# EAGLE board FlipDot (EAGLE 7.5.0), part 1 of 2
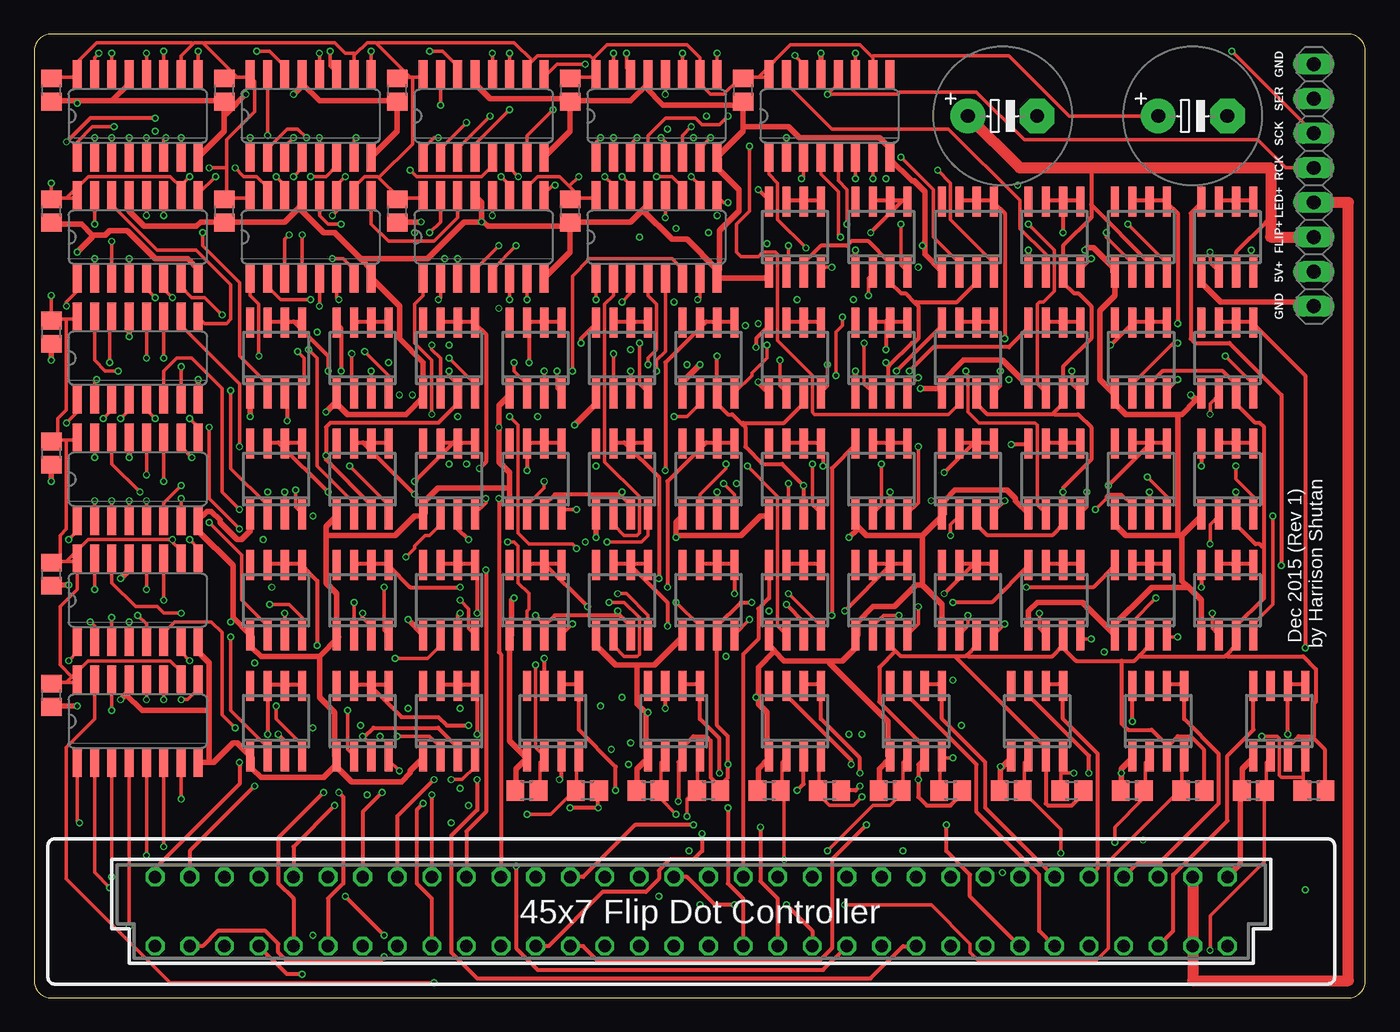
[diagram p9: board, top side]
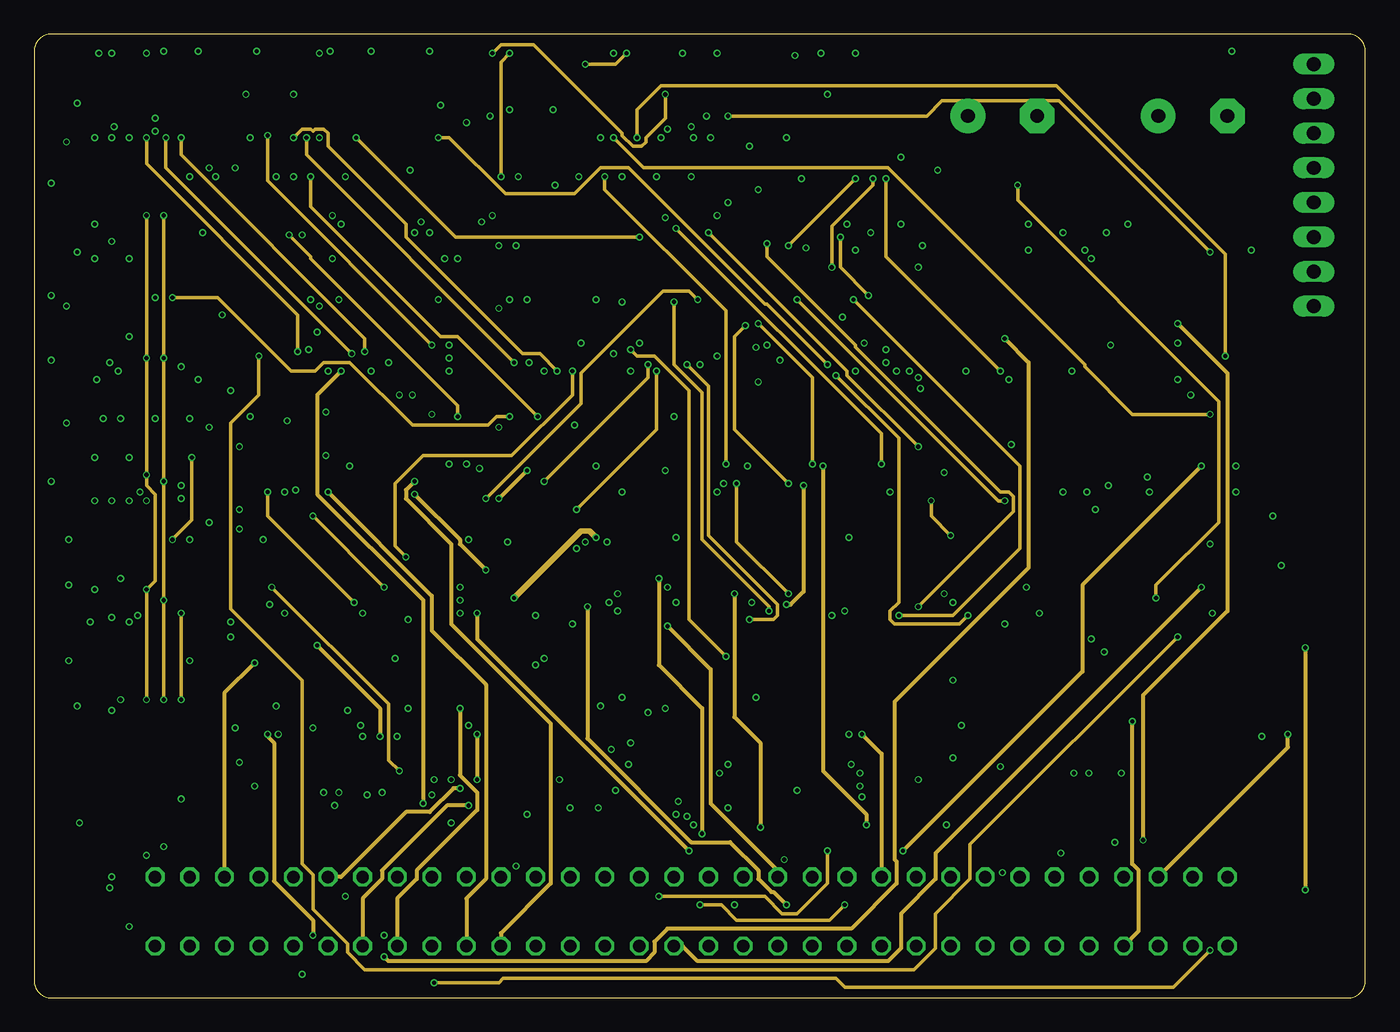
[diagram p10: board, inner layer Route2]
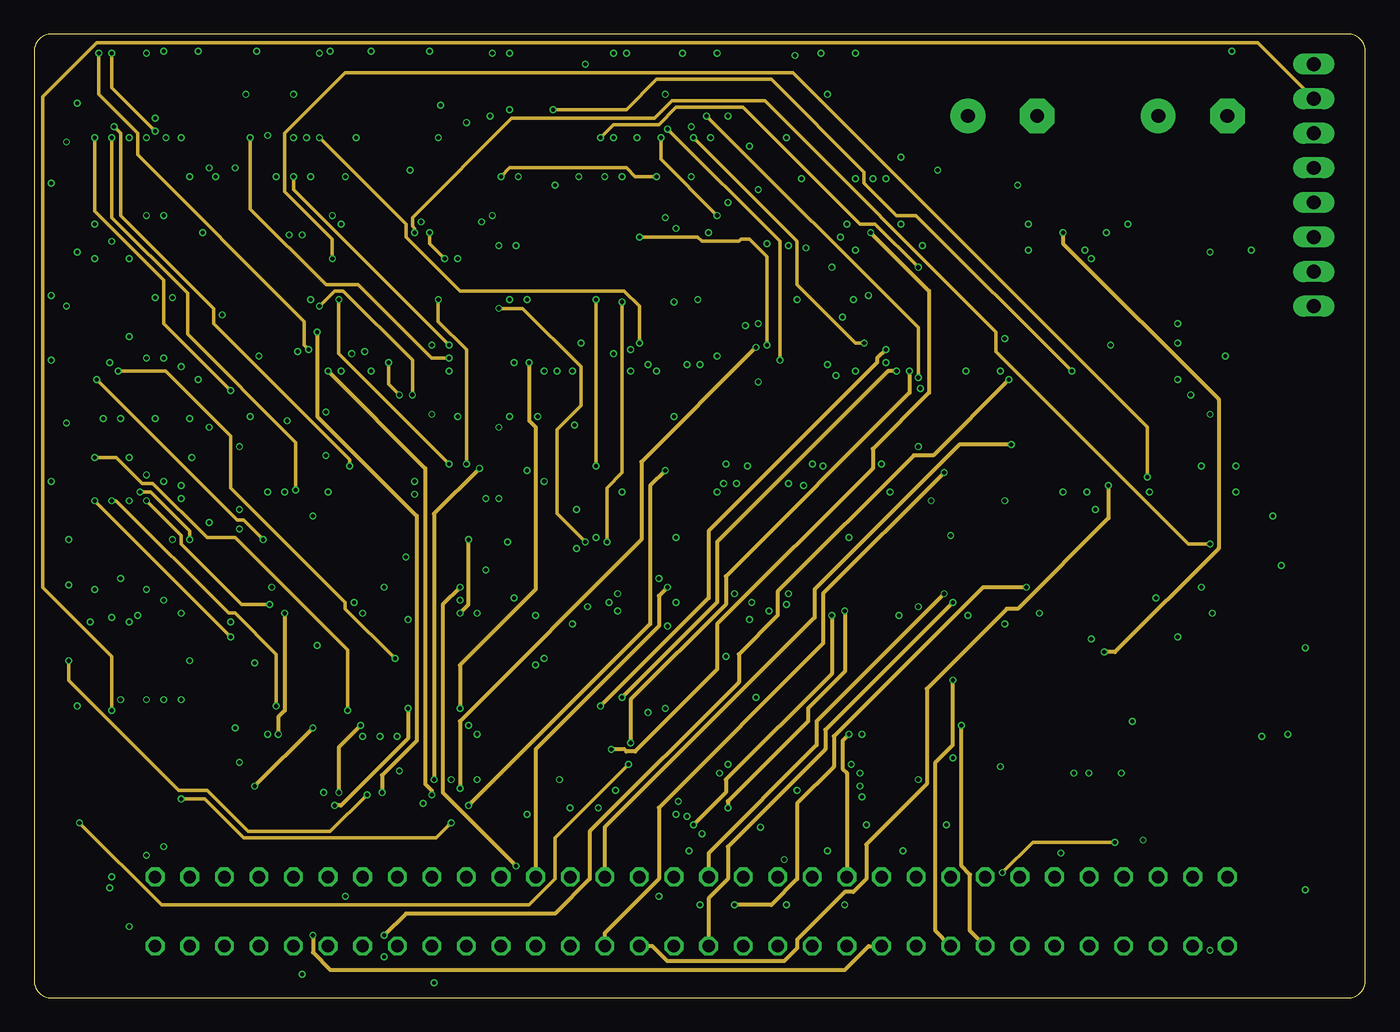
[diagram p11: board, inner layer Route15]
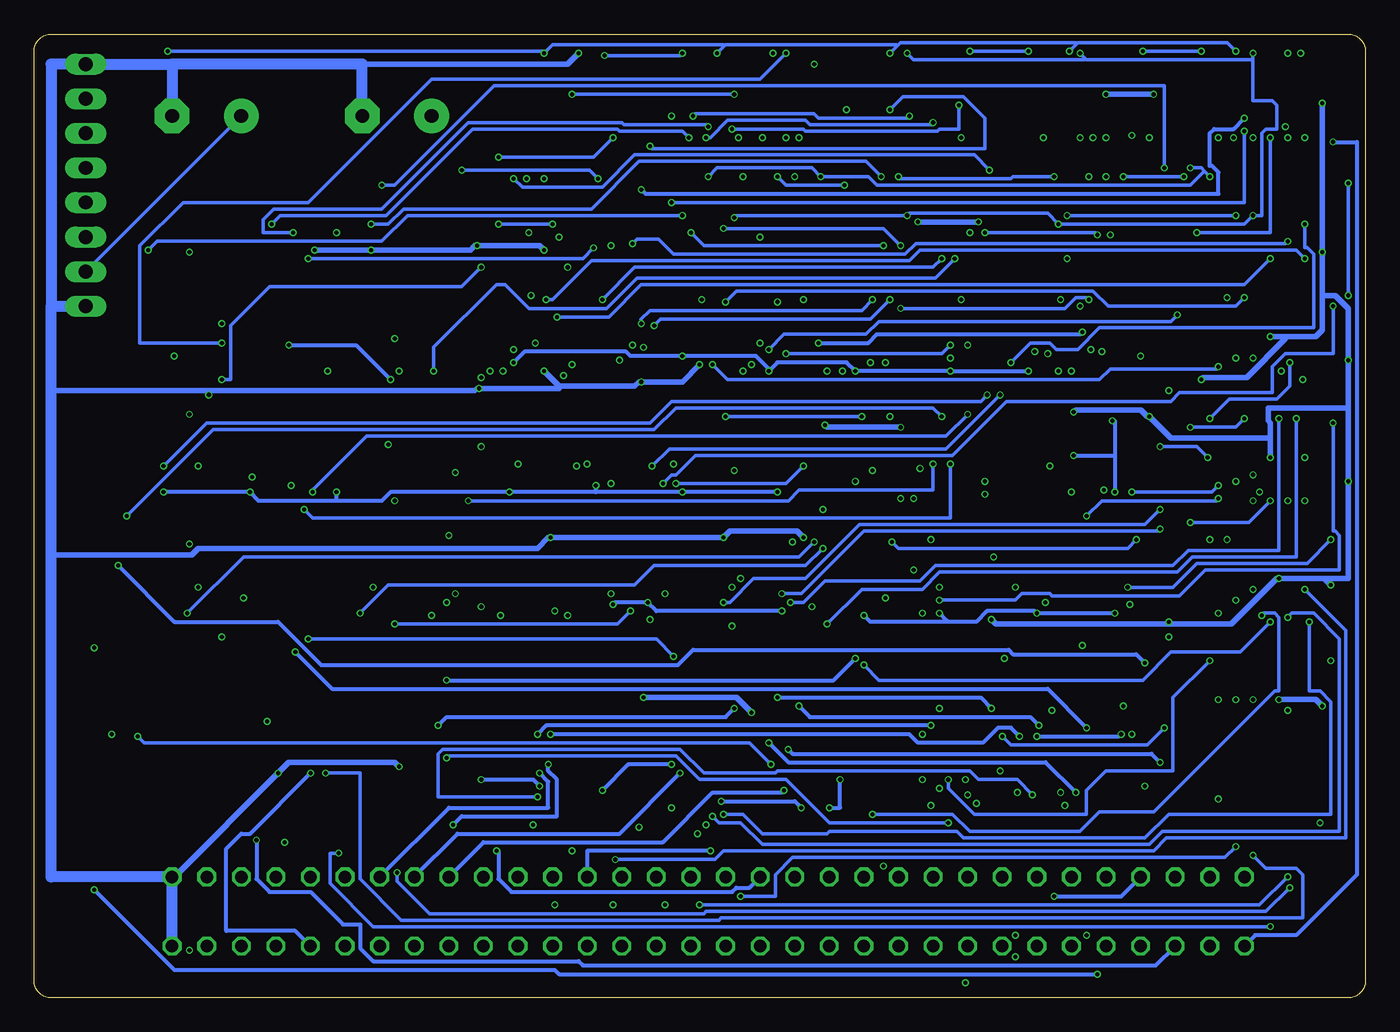
[diagram p12: board, bottom side, seen from below]

Size 97.77 x 70.79 mm. Coordinates in mm from the lower left corner, seen from the top.
Outline: 0,69.52 0,1.27 arc90 1.27,0 96.5,0 arc90 97.77,1.27 97.77,69.52 arc90 96.5,70.79 1.27,70.79 arc90 0,69.52
Copper layers (1*2*15*16): Top 0.035559375mm / dielectric 0.17018125mm / Route2 0.01778125mm / dielectric 47mil / Route15 0.01778125mm / dielectric 0.17018125mm / Bottom 0.035559375mm
Design rules "OSHPark-4layer": minimum track width 5mil, minimum drill 10mil, track to track 5mil, track to pad 5mil, pad to pad 5mil, via to via 5mil, smd to smd 5mil, copper to edge 15mil, drill to drill 6mil, minimum pad ring 4mil, minimum via ring 4mil, stop-mask expansion 2.5mil, vias tented up to drill 0mil, thermal gap 10mil
Net classes: 0 default: width 0.254 mm, drill 0.305 mm, clearance 0.203 mm; 1 flipvoltpositive: width 0.305 mm, drill 0.305 mm, clearance 0.203 mm; 2 ledpos: width 0.762 mm, drill 0.305 mm, clearance 0.203 mm; 3 gnd: width 0.406 mm, drill 0.305 mm, clearance 0.203 mm; 4 fetcommons: width 0.305 mm, drill 0.305 mm, clearance 0.203 mm

## Footprints (pad centres in the part's own frame; a part is rotated, then mirrored left to right if it is on the bottom)
C2012 = smd 1.3 x 1.5: 1 -0.85,0; 2 0.85,0
SO8 = smd 0.6 x 2.2: 1 -1.905,-2.6; 2 -0.635,-2.6; 3 0.635,-2.6; 4 1.905,-2.6; 5 1.905,2.6; 6 0.635,2.6; 7 -0.635,2.6; 8 -1.905,2.6
E5-10,5 = drill 1.016 pad 2.54: + -2.54,0 | drill 1.016 pad 2.54 octagon: - 2.54,0
1X08 = drill 1.016 long: 1 -8.89,0; 2 -6.35,0; 3 -3.81,0; 4 -1.27,0; 5 1.27,0; 6 3.81,0; 7 6.35,0; 8 8.89,0
R2012 = smd 1.3 x 1.5: 1 -0.85,0; 2 0.85,0
SO16 = smd 0.66 x 2.032: 1 -4.445,-3.073; 2 -3.175,-3.073; 3 -1.905,-3.073; 4 -0.635,-3.073; 5 0.635,-3.073; 6 1.905,-3.073; 7 3.175,-3.073; 8 4.445,-3.073; 9 4.445,3.073; 10 3.175,3.073; 11 1.905,3.073; 12 0.635,3.073; 13 -0.635,3.073; 14 -1.905,3.073; 15 -3.175,3.073; 16 -4.445,3.073
FAC64S = drill 0.914 octagon: A1 -2.54,39.37; A2 -2.54,36.83; A3 -2.54,34.29; A4 -2.54,31.75; A5 -2.54,29.21; A6 -2.54,26.67; A7 -2.54,24.13; A8 -2.54,21.59; A9 -2.54,19.05; A10 -2.54,16.51; A11 -2.54,13.97; A12 -2.54,11.43; A13 -2.54,8.89; A14 -2.54,6.35; A15 -2.54,3.81; A16 -2.54,1.27; A17 -2.54,-1.27; A18 -2.54,-3.81; A19 -2.54,-6.35; A20 -2.54,-8.89; A21 -2.54,-11.43; A22 -2.54,-13.97; A23 -2.54,-16.51; A24 -2.54,-19.05; A25 -2.54,-21.59; A26 -2.54,-24.13; A27 -2.54,-26.67; A28 -2.54,-29.21; A29 -2.54,-31.75; A30 -2.54,-34.29; A31 -2.54,-36.83; A32 -2.54,-39.37; C1 2.54,39.37; C2 2.54,36.83; C3 2.54,34.29; C4 2.54,31.75; C5 2.54,29.21; C6 2.54,26.67; C7 2.54,24.13; C8 2.54,21.59; C9 2.54,19.05; C10 2.54,16.51; C11 2.54,13.97; C12 2.54,11.43; C13 2.54,8.89; C14 2.54,6.35; C15 2.54,3.81; C16 2.54,1.27; C17 2.54,-1.27; C18 2.54,-3.81; C19 2.54,-6.35; C20 2.54,-8.89; C21 2.54,-11.43; C22 2.54,-13.97; C23 2.54,-16.51; C24 2.54,-19.05; C25 2.54,-21.59; C26 2.54,-24.13; C27 2.54,-26.67; C28 2.54,-29.21; C29 2.54,-31.75; C30 2.54,-34.29; C31 2.54,-36.83; C32 2.54,-39.37

## Placement (x,y rotation side)
C1  [C2012]  1.27,22.23 270 top
C2  [C2012]  1.27,31.11 270 top
C3  [C2012]  1.27,40.01 270 top
C4  [C2012]  1.27,48.9 270 top
C5  [C2012]  1.27,57.78 270 top
C6  [C2012]  13.97,57.78 270 top
C7  [C2012]  26.67,57.78 270 top
C8  [C2012]  39.37,57.78 270 top
C9  [C2012]  1.27,66.67 270 top
C10  [C2012]  13.97,66.67 270 top
C11  [C2012]  26.67,66.67 270 top
C12  [C2012]  39.37,66.67 270 top
C13  [C2012]  52.07,66.67 270 top
COL1.  AO4629  [SO8]  30.48,20.32 0 top
COL2.  AO4629  [SO8]  24.13,20.32 0 top
COL3.  AO4629  [SO8]  17.78,20.32 0 top
COL4.  AO4629  [SO8]  17.78,29.21 0 top
COL5.  AO4629  [SO8]  24.13,29.21 0 top
COL6.  AO4629  [SO8]  30.48,29.21 0 top
COL7.  [SO8]  36.83,29.21 0 top
COL8.  [SO8]  43.18,29.21 0 top
COL9.  [SO8]  49.53,29.21 0 top
COL10.  [SO8]  55.88,29.21 0 top
COL11.  [SO8]  62.23,29.21 0 top
COL12.  [SO8]  68.58,29.21 0 top
COL13.  [SO8]  74.93,29.21 0 top
COL14.  [SO8]  81.28,29.21 0 top
COL15.  [SO8]  87.63,29.21 0 top
COL16.  [SO8]  87.63,38.1 0 top
COL17.  [SO8]  81.28,38.1 0 top
COL18.  [SO8]  74.93,38.1 0 top
COL19.  [SO8]  68.58,38.1 0 top
COL20.  [SO8]  62.23,38.1 0 top
COL21.  [SO8]  55.88,38.1 0 top
COL22.  [SO8]  49.53,38.1 0 top
COL23.  [SO8]  43.18,38.1 0 top
COL24.  [SO8]  36.83,38.1 0 top
COL25.  [SO8]  30.48,38.1 0 top
COL26.  [SO8]  24.13,38.1 0 top
COL27.  [SO8]  17.78,38.1 0 top
COL28.  [SO8]  17.78,46.99 0 top
COL29.  [SO8]  24.13,46.99 0 top
COL30.  [SO8]  30.48,46.99 0 top
COL31.  [SO8]  36.83,46.99 0 top
COL32.  [SO8]  43.18,46.99 0 top
COL33.  [SO8]  49.53,46.99 0 top
COL34.  [SO8]  55.88,46.99 0 top
COL35.  [SO8]  62.23,46.99 0 top
COL36.  [SO8]  68.58,46.99 0 top
COL37.  [SO8]  74.93,46.99 0 top
COL38.  [SO8]  81.28,46.99 0 top
COL39.  [SO8]  87.63,46.99 0 top
COL40.  [SO8]  87.63,55.88 0 top
COL41.  [SO8]  81.28,55.88 0 top
COL42.  [SO8]  74.93,55.88 0 top
COL43.  [SO8]  68.58,55.88 0 top
COL44.  [SO8]  62.23,55.88 0 top
COL45.  [SO8]  55.88,55.88 0 top
FLIPCAP  [E5-10,5]  71.12,64.77 0 top
JP1  [1X08]  93.98,59.69 90 top
LOGICCAP  [E5-10,5]  85.09,64.77 0 top
R1  10k  [R2012]  89.53,15.24 0 top
R2  10k  [R2012]  93.98,15.24 0 top
R3  10k  [R2012]  80.64,15.24 0 top
R4  10k  [R2012]  85.09,15.24 0 top
R5  10k  [R2012]  71.75,15.24 0 top
R6  10k  [R2012]  76.2,15.24 0 top
R7  10k  [R2012]  62.87,15.24 0 top
R8  10k  [R2012]  67.31,15.24 0 top
R9  10k  [R2012]  53.98,15.24 0 top
R10  10k  [R2012]  58.42,15.24 0 top
R11  10k  [R2012]  45.09,15.24 0 top
R12  10k  [R2012]  49.53,15.24 0 top
R13  10k  [R2012]  36.2,15.24 0 top
R14  10k  [R2012]  40.64,15.24 0 top
ROW1.  [SO8]  91.44,20.32 0 top
ROW2.  [SO8]  82.55,20.32 0 top
ROW3.  [SO8]  73.66,20.32 0 top
ROW4.  [SO8]  64.77,20.32 0 top
ROW5.  [SO8]  55.88,20.32 0 top
ROW6.  [SO8]  46.99,20.32 0 top
ROW7.  [SO8]  38.1,20.32 0 top
SR1  74LS595D  [SO16]  7.62,20.32 0 top
SR2  74LS595D  [SO16]  7.62,29.21 0 top
SR3  74LS595D  [SO16]  7.62,38.1 0 top
SR4  74LS595D  [SO16]  7.62,46.99 0 top
SR5  74LS595D  [SO16]  7.62,55.88 0 top
SR6  74LS595D  [SO16]  20.32,55.88 0 top
SR7  74LS595D  [SO16]  33.02,55.88 0 top
SR8  74LS595D  [SO16]  45.72,55.88 0 top
SR9  74LS595D  [SO16]  7.62,64.77 0 top
SR10  74LS595D  [SO16]  20.32,64.77 0 top
SR11  74LS595D  [SO16]  33.02,64.77 0 top
SR12  74LS595D  [SO16]  45.72,64.77 0 top
SR13  74LS595D  [SO16]  58.42,64.77 0 top
X1  FAC64S  [FAC64S]  48.26,6.35 270 top

## Tracks (layer width: path | path; a pad name or v marks a point on that pad's centre or on a via)
COL1COMMON  (via drill 0.3)
  Top 0.305: 31.11,23.02 29.84,23.02 COL1..7 | 31.11,23.02 32.38,23.02 COL1..5 32.38,22.86 32.54,22.7 v32.54,19.37 | 31.11,23.02 COL1..6 | X1.C10 63.82,3.81 61.44,1.43 32.54,1.43 30.64,3.33 30.64,11.91 32.54,13.81 v32.54,16.03
  Route2 0.305: v32.54,19.37 v32.54,16.03
COL2COMMON  (via drill 0.3)
  Top 0.305: 24.77,23.02 23.5,23.02 COL2..7 | 24.77,23.02 26.04,23.02 COL2..5 | 24.77,23.02 COL2..6 24.77,22.86 26.99,20.64 29.69,20.64 30.32,20 v31.91,20
  Route2 0.305: X1.A11 62.23,17.94 v60.8,19.37
  Bottom 0.305: v60.8,19.37 60.17,20 v31.91,20
COL3COMMON  (via drill 0.3)
  Top 0.305: 18.41,23.02 17.14,23.02 COL3..7 v17.14,19.37 | 18.41,23.02 19.68,23.02 COL3..5 | 18.41,23.02 COL3..6
  Route2 0.305: v20.48,4.6 20.48,5.71 17.62,8.57 17.62,18.73 17.14,19.21 v17.14,19.37
  Route15 0.305: X1.C11 61.28,3.81 59.53,2.06 21.75,2.06 20.48,3.33 v20.48,4.6
COL4COMMON  (via drill 0.3)
  Top 0.305: 18.41,31.91 17.14,31.91 COL4..7 | 18.41,31.91 19.68,31.91 COL4..5 19.68,31.75 20.8,30.64 v20.8,25.88 | 18.41,31.91 COL4..6
  Route2 0.305: v25.4,19.21 25.4,21.27 v20.8,25.88
  Route15 0.305: X1.A12 59.69,16.51 59.37,16.83 59.37,18.89 v59.85,19.37
  Bottom 0.305: v59.85,19.37 33.5,19.37 32.86,18.73 28.1,18.73 26.99,19.84 26.04,19.84 v25.4,19.21
COL5COMMON  (via drill 0.3)
  Top 0.305: 24.77,31.91 23.5,31.91 COL5..7 | 24.77,31.91 26.04,31.91 COL5..5 26.04,31.75 27.62,30.16 v31.27,30.16 | 24.77,31.91 COL5..6 | X1.C12 57.94,2.06 36.99,2.06 35.4,3.65 v35.4,9.68
  Route15 0.305: v35.4,9.68 30,15.08 30,28.89 v31.27,30.16
COL6COMMON  (via drill 0.3)
  Top 0.305: 31.11,31.91 29.84,31.91 COL6..7 | 31.11,31.91 32.38,31.91 COL6..5 32.38,31.75 32.54,31.59 v32.54,28.26 | 31.11,31.91 COL6..6
  Route2 0.305: v48.1,10.79 32.54,26.35 v32.54,28.26
  Bottom 0.305: X1.A13 57.15,10.79 v48.1,10.79
COL7COMMON  (via drill 0.3)
  Top 0.305: 37.47,31.91 36.2,31.91 COL7..7 | 37.47,31.91 38.73,31.91 COL7..5 | X1.C13 57.15,4.92 v55.24,6.83 | 37.47,31.91 v40.64,28.73 | 37.47,31.91 COL7..6
  Route2 0.305: v55.24,6.83 54.29,7.78 54.13,7.78 53.18,8.73 53.18,9.37 51.12,11.43 48.26,11.43 40.64,19.05 v40.64,28.73
COL8COMMON  (via drill 0.3)
  Top 0.305: 43.81,31.91 42.55,31.91 COL8..7 | 43.81,31.91 45.09,31.91 COL8..5 | 43.81,31.91 COL8..6 43.81,31.75 46.51,29.05 v46.51,27.3
  Route2 0.305: X1.A14 54.61,9.37 49.69,14.29 49.69,24.13 v46.51,27.3
COL9COMMON  (via drill 0.3)
  Top 0.305: 50.16,31.91 48.9,31.91 COL9..7 | 50.16,31.91 51.44,31.91 COL9..5 v51.44,29.69 | 50.16,31.91 COL9..6 | X1.C14 54.61,7.3 53.34,8.57 v53.34,12.54
  Route2 0.305: v53.34,12.54 53.34,18.73 51.44,20.64 v51.44,29.69
COL10COMMON
  Top 0.305: 56.52,31.91 55.24,31.91 COL10..7 | 56.52,31.91 57.78,31.91 COL10..5 | 56.52,31.91 COL10..6 | X1.A15 52.07,25.24 53.18,26.35 53.18,28.57 53.98,29.37 COL10..8
COL11COMMON  (via drill 0.3)
  Top 0.305: 62.87,31.91 61.59,31.91 COL11..7 | 62.87,31.91 64.14,31.91 COL11..5 | 62.87,31.91 COL11..6 62.87,31.75 v59.53,28.42 | X1.C15 52.07,7.3 50.96,8.41 v50.96,13.97
  Route15 0.305: v50.96,13.97 50.96,14.45 56.83,20.32 56.83,21.27 59.53,23.97 v59.53,28.42
COL12COMMON  (via drill 0.3)
  Top 0.305: 69.06,31.91 67.94,31.91 COL12..7 | 69.06,31.91 69.22,31.91 | 69.22,31.91 70.48,31.91 COL12..5 | 69.22,31.91 COL12..6 69.06,31.91 | 69.06,31.91 v66.83,29.69
  Route15 0.305: X1.A16 49.53,10.64 57.47,18.57 57.47,20.32 v66.83,29.69
COL13COMMON  (via drill 0.3)
  Top 0.305: 75.56,31.91 74.3,31.91 COL13..7 | 75.56,31.91 76.83,31.91 COL13..5 | 75.56,31.91 COL13..6 | v67.47,29.05 70.33,29.05 73.03,31.75 COL13..8
  Route15 0.305: X1.C16 49.53,7.3 50.96,8.73 50.96,11.11 58.1,18.26 58.1,19.68 v67.47,29.05
COL14COMMON  (via drill 0.3)
  Top 0.305: 81.92,31.91 80.64,31.91 COL14..7 | 81.92,31.91 83.19,31.91 COL14..5 | 81.92,31.91 COL14..6 | X1.A17 47.94,8.89 50.01,6.83 v51.44,6.83 | v72.87,30.16 77.79,30.16 79.38,31.75 COL14..8
  Route15 0.305: v51.44,6.83 54.13,6.83 56.04,8.73 56.04,14.29 58.74,16.99 58.74,19.21 69.69,30.16 v72.87,30.16
COL15COMMON  (via drill 0.3)
  Top 0.305: 88.27,31.91 87,31.91 COL15..7 | 88.27,31.91 89.53,31.91 COL15..5 | 88.27,31.91 COL15..6 | COL15..8 v85.72,30.16
  Route2 0.305: X1.C17 47.62,3.81 48.74,2.7 62.71,2.7 63.66,3.65 63.66,6.19 66.2,8.73 66.2,10.64 v85.72,30.16
COL16COMMON  (via drill 0.3)
  Top 0.305: 88.27,40.8 87,40.8 COL16..7 | 88.27,40.8 89.53,40.8 COL16..5 | 88.27,40.8 COL16..6 | COL16..8 v85.72,39.05
  Route2 0.305: v63.82,10.79 76.99,23.97 76.99,30.32 v85.72,39.05
  Bottom 0.305: X1.A18 45.24,8.1 46.2,8.1 46.51,7.78 62.71,7.78 63.66,8.73 63.66,10.79 v63.82,10.79
COL17COMMON  (via drill 0.3)
  Top 0.305: 81.92,40.8 80.64,40.8 COL17..7 | 81.92,40.8 83.19,40.8 COL17..5 | 81.92,40.8 COL17..6 81.92,40.64 v78.9,37.62
  Route15 0.305: X1.C18 45.4,3.81 46.51,2.7 55.09,2.7 56.04,3.65 56.04,4.29 59.53,7.78 60.17,7.78 61.12,8.73 61.12,11.27 65.56,15.72 65.56,22.7 71.44,28.57 72.23,28.57 78.9,35.24 v78.9,37.62
COL18COMMON  (via drill 0.3)
  Top 0.305: 75.56,40.8 74.3,40.8 COL18..7 | 75.56,40.8 76.83,40.8 COL18..5 | 75.56,40.8 COL18..6 | v71.75,40.64 73.03,40.64 COL18..8
  Route15 0.305: X1.A19 41.91,12.54 57.31,27.94 57.31,30 67.94,40.64 v71.75,40.64
COL19COMMON  (via drill 0.3)
  Top 0.305: 69.06,40.8 67.94,40.8 COL19..7 | 69.06,40.8 69.22,40.8 | 69.22,40.8 70.48,40.8 COL19..5 | 69.22,40.8 COL19..6 69.06,40.8 | 69.06,40.8 v66.83,38.58
  Route15 0.305: X1.C19 41.91,4.76 45.88,8.73 45.88,13.97 57.94,26.04 57.94,29.69 v66.83,38.58
COL20COMMON  (via drill 0.3)
  Top 0.305: 62.87,40.8 61.59,40.8 COL20..7 | 62.87,40.8 64.14,40.8 COL20..5 | 62.87,40.8 COL20..6 | X1.A20 40.32,8.89 44.13,12.7 v48.42,12.7 | v58.58,28.1 58.58,38.89 60.33,40.64 COL20..8
  Route15 0.305: v48.42,12.7 50.8,15.08 50.8,16.03 58.58,23.81 v58.58,28.1
COL21COMMON  (via drill 0.3)
  Top 0.305: 56.52,40.8 55.24,40.8 COL21..7 | 56.52,40.8 57.78,40.8 COL21..5 57.78,40.64 57.94,40.48 v57.94,39.05 | 56.52,40.8 COL21..6 | X1.C20 40.32,3.81 41.43,2.7 57.63,2.7 58.58,3.65 58.58,10.16 v61.12,12.7
  Route2 0.305: v61.12,12.7 61.12,13.49 57.94,16.67 v57.94,39.05
COL22COMMON  (via drill 0.3)
  Top 0.305: 49.37,40.8 48.9,40.8 COL22..7 | 49.37,40.8 50.16,40.8 | 50.16,40.8 51.44,40.8 COL22..5 | 50.16,40.8 COL22..6 | v46.51,30.16 46.51,37.94 49.37,40.8
  Route15 0.305: X1.A21 36.83,18.26 45.88,27.3 45.88,29.53 v46.51,30.16
COL23COMMON  (via drill 0.3)
  Top 0.305: 43.34,40.8 42.55,40.8 COL23..7 | 43.34,40.8 43.81,40.8 | 43.81,40.8 45.09,40.8 COL23..5 | 43.81,40.8 COL23..6 | X1.C21 37.78,3.81 41.75,7.78 44.93,7.78 45.88,8.73 45.88,9.37 46.67,10.16 48.42,10.16 49.05,10.79 v49.05,12.06 | v45.88,30.8 45.88,38.26 43.34,40.8
  Route2 0.305: v49.05,12.06 49.05,21.27 45.88,24.45 v45.88,30.8
COL24COMMON  (via drill 0.3)
  Top 0.305: 37.47,40.8 36.2,40.8 COL24..7 v36.2,38.73 | 37.47,40.8 38.73,40.8 COL24..5 | 37.47,40.8 COL24..6 | X1.A22 34.29,25.24 34.13,25.4 v34.13,36.67
  Route2 0.305: v36.2,38.73 v34.13,36.67
COL25COMMON  (via drill 0.3)
  Top 0.305: 30.8,40.8 29.84,40.8 COL25..7 | 30.8,40.8 31.11,40.8 | 31.11,40.8 32.38,40.8 COL25..5 | 31.11,40.8 COL25..6 | 30.8,40.8 v27.94,37.94
  Route2 0.305: X1.C22 34.29,4.76 37.94,8.41 37.94,20.16 30.64,27.46 30.64,33.34 27.3,36.67 27.3,37.31 v27.94,37.94
COL26COMMON  (via drill 0.3)
  Top 0.305: 24.13,40.8 23.5,40.8 COL26..7 | 24.13,40.8 24.77,40.8 | 24.77,40.8 26.04,40.8 COL26..5 | 24.77,40.8 COL26..6 | X1.A23 31.75,12.22 33.18,13.65 v33.18,31.43 | 24.13,40.8 v27.94,36.99
  Route2 0.305: v33.18,31.43 31.27,33.34 31.27,33.66 v27.94,36.99
COL27COMMON  (via drill 0.3)
  Top 0.305: 17.94,40.8 17.14,40.8 COL27..7 | 17.94,40.8 18.41,40.8 | 18.41,40.8 19.68,40.8 COL27..5 | 18.41,40.8 COL27..6 | 17.94,40.8 v21.59,37.15
  Route2 0.305: X1.C23 31.75,7.3 33.18,8.73 33.18,23.02 29.21,26.99 29.21,29.53 v21.59,37.15
COL28COMMON  (via drill 0.3)
  Top 0.305: 18.41,49.69 17.14,49.69 COL28..7 | 18.41,49.69 19.05,49.69 | 19.05,49.69 19.68,49.69 COL28..5 | 18.41,49.69 COL28..6 | v29.21,14.92 X1.A24 | v21.59,46.04 21.59,47.15 19.05,49.69
  Route15 0.305: v29.21,14.92 29.21,15.24 28.73,15.72 28.73,38.89 v21.59,46.04
COL29COMMON  (via drill 0.3)
  Top 0.305: 24.77,49.69 23.5,49.69 COL29..7 | 24.77,49.69 26.04,49.69 COL29..5 | 24.77,49.69 COL29..6 | X1.C24 29.21,7.3 28.1,8.41 28.1,13.81 v28.57,14.29 | v22.54,46.04 22.54,49.21 22.23,49.53 COL29..8
  Route2 0.305: v28.57,14.29 28.57,29.21 20.8,36.99 20.8,44.29 v22.54,46.04
COL30COMMON  (via drill 0.3)
  Top 0.305: 31.11,49.69 29.84,49.69 COL30..7 | 31.11,49.69 32.38,49.69 COL30..5 32.38,49.53 33.18,48.74 33.18,39.37 v32.7,38.89 | 31.11,49.69 COL30..6 | X1.A25 26.67,13.34 v29.37,16.03
  Route15 0.305: v29.37,16.03 29.37,35.56 v32.7,38.89
COL31COMMON  (via drill 0.3)
  Top 0.305: 36.35,49.69 36.2,49.69 COL31..7 36.35,49.69 | 36.35,49.69 37.47,49.69 | 37.47,49.69 38.73,49.69 COL31..5 | 37.47,49.69 COL31..6 | 36.35,49.69 v36.35,46.67
  Route2 0.305: X1.C25 26.67,7.3 28.1,8.73 28.1,9.37 32.54,13.81 32.54,15.08 31.27,16.35 v31.27,21.27
  Route15 0.305: v31.27,21.27 31.27,24.45 36.83,30 36.83,41.91 36.35,42.39 v36.35,46.67
COL32COMMON  (via drill 0.3)
  Top 0.305: 43.81,49.69 42.55,49.69 COL32..7 | 43.81,49.69 45.09,49.69 COL32..5 | 43.81,49.69 COL32..6 | X1.A26 24.13,13.65 v25.56,15.08 | v40.16,48.1 40.16,48.42 41.27,49.53 COL32..8
  Route15 0.305: v25.56,15.08 25.56,16.35 28.1,18.89 28.1,35.4 20.8,42.7 v20.8,48.9
  Bottom 0.305: v20.8,48.9 20.95,48.74 35.88,48.74 36.51,48.1 v40.16,48.1
COL33COMMON  (via drill 0.3)
  Top 0.305: 49.37,49.69 48.9,49.69 COL33..7 | 49.37,49.69 50.16,49.69 | 50.16,49.69 51.44,49.69 COL33..5 | 50.16,49.69 COL33..6 | v46.35,38.73 46.35,46.67 49.37,49.69
  Route2 0.305: X1.C26 24.13,7.3 25.56,8.73 25.56,9.37 30.32,14.13 v31.91,14.13
  Route15 0.305: v31.91,14.13 45.24,27.46 45.24,37.62 v46.35,38.73
COL34COMMON  (via drill 0.3)
  Top 0.305: 56.52,49.69 55.24,49.69 COL34..7 | 56.52,49.69 57.78,49.69 COL34..5 | 56.52,49.69 COL34..6 | v53.02,47.78 53.02,48.42 53.98,49.37 COL34..8
  Route2 0.305: X1.A27 22.54,8.89 27.3,13.65 29.05,13.65 30.8,15.4 v31.27,15.4
  Route15 0.305: v31.27,15.4 31.27,20.32 44.61,33.66 44.61,39.37 v53.02,47.78
COL35COMMON  (via drill 0.3)
  Top 0.305: 62.55,49.69 61.59,49.69 COL35..7 | 62.55,49.69 62.87,49.69 | 62.87,49.69 64.14,49.69 COL35..5 | 62.87,49.69 COL35..6 | X1.C27 21.59,7.3 22.7,8.41 22.7,14.76 v22.38,15.08 | 62.55,49.69 v62.55,47.62
  Route15 0.305: v22.38,15.08 22.38,18.41 v23.97,20 | v41.59,21.43 49.53,29.37 49.53,34.29 61.91,46.67 61.91,46.99 v62.55,47.62
  Bottom 0.305: v23.97,20 24.61,20.64 40.8,20.64 v41.59,21.43
COL36COMMON  (via drill 0.3)
  Top 0.305: 69.22,49.69 67.94,49.69 COL36..7 | 69.22,49.69 70.48,49.69 COL36..5 | 69.22,49.69 COL36..6 | X1.A28 19.05,11.11 v22.07,14.13 | v63.34,46.04 66.67,49.37 COL36..8
  Route15 0.305: v22.07,14.13 22.54,14.13 27.46,19.05 v27.46,21.27 | v43.18,22.07 50.16,29.05 50.16,33.5 62.71,46.04 v63.34,46.04
  Bottom 0.305: v27.46,21.27 28.26,22.07 v43.18,22.07
COL37COMMON  (via drill 0.3)
  Top 0.305: 75.56,49.69 74.3,49.69 COL37..7 | 75.56,49.69 76.83,49.69 COL37..5 | 75.56,49.69 COL37..6 | X1.C28 19.05,7.3 17.94,8.41 17.94,11.75 v21.27,15.08 | v64.29,46.04 66.04,47.78 71.6,47.78 73.03,49.21 COL37..8
  Route15 0.305: v43.81,18.73 43.81,21.91 50.8,28.89 50.8,30.96 64.29,44.45 v64.29,46.04
  Bottom 0.305: v21.27,15.08 23.5,17.3 42.39,17.3 v43.81,18.73
COL38COMMON  (via drill 0.3)
  Top 0.305: 81.92,49.69 80.64,49.69 COL38..7 80.64,49.53 v79.06,47.94 | 81.92,49.69 83.19,49.69 COL38..5 | 81.92,49.69 COL38..6 | v25.72,4.6 v22.86,7.46
  Route15 0.305: v25.72,4.6 27.3,6.19 38.26,6.19 40.8,8.73 40.8,12.22 51.75,23.18 51.75,25.24 54.61,28.1 54.61,29.84 64.61,39.85 66.04,39.85 v71.6,45.4
  Bottom 0.305: X1.A29 17.94,7.46 v22.86,7.46 | v71.6,45.4 74.14,47.94 v79.06,47.94
COL39COMMON  (via drill 0.3)
  Top 0.305: 88.27,49.69 87,49.69 COL39..7 | 88.27,49.69 89.53,49.69 COL39..5 89.53,49.53 93.34,45.72 v93.34,25.72 | 88.27,49.69 COL39..6 | X1.C29 18.57,1.75 v19.68,1.75
  Route2 0.305: v93.34,25.72 v93.34,7.94
  Bottom 0.305: v19.68,1.75 59.21,1.75 59.53,2.06 87.47,2.06 v93.34,7.94
COL40COMMON  (via drill 0.3)
  Top 0.305: 88.27,58.58 87,58.58 COL40..7 | 88.27,58.58 89.53,58.58 COL40..5 | 88.27,58.58 COL40..6 | v91.6,31.75 91.6,44.29 87.79,48.1 85.25,48.1 84.93,48.42 84.93,57.63 85.72,58.42 COL40..8
  Route2 0.305: X1.A30 13.97,22.38 v16.19,24.61
  Bottom 0.305: v16.19,24.61 16.83,25.24 25.88,25.24 26.19,25.56 49.37,25.56 50.48,24.45 76.68,24.45 79.85,27.62 87.47,27.62 v91.6,31.75
COL41COMMON  (via drill 0.3)
  Top 0.305: 81.92,58.58 80.64,58.58 COL41..7 | 81.92,58.58 83.19,58.58 COL41..5 83.19,58.42 83.98,57.63 v83.98,49.53 | 81.92,58.58 COL41..6
  Route2 0.305: v81.44,11.59 81.44,22.23 87.63,28.42 87.63,45.88 v83.98,49.53
  Bottom 0.305: X1.C30 15.4,2.38 57.47,2.38 57.78,2.7 72.87,2.7 73.82,3.65 73.82,5.4 75.09,5.4 77.47,7.78 80.49,7.78 81.44,8.73 v81.44,11.59
COL42COMMON  (via drill 0.3)
  Top 0.305: 75.56,58.58 74.3,58.58 COL42..7 | 75.56,58.58 76.83,58.58 COL42..5 | 75.56,58.58 COL42..6 v75.56,56.2 | X1.A31 11.43,10.79 v16.19,15.56
  Route15 0.305: v20.48,19.84 v16.19,15.56 | v78.58,25.4 79.38,25.4 87,33.02 87,43.97 75.56,55.4 v75.56,56.2
  Bottom 0.305: v20.48,19.84 23.34,22.7 75.88,22.7 v78.58,25.4
COL43COMMON  (via drill 0.3)
  Top 0.305: 69.22,58.58 67.94,58.58 COL43..7 | 69.22,58.58 70.48,58.58 COL43..5 70.48,58.42 71.28,57.63 v71.28,48.42 | 69.22,58.58 COL43..6 | X1.C31 12.38,3.81 13.49,4.92 16.99,4.92 17.94,3.97 17.94,3.33 18.57,2.7 25.4,2.7 v25.72,3.02
  Route2 0.305: v25.72,3.02 26.04,2.7 44.93,2.7 45.56,3.33 45.56,4.13 46.51,5.08 60.01,5.08 63.34,8.41 63.34,10 63.18,10.16 63.18,21.75 73.03,31.59 73.03,46.67 v71.28,48.42
COL44COMMON  (via drill 0.3)
  Top 0.305: 62.87,58.58 61.59,58.58 COL44..7 | 62.87,58.58 63.82,58.58 | 63.82,58.58 64.14,58.58 COL44..5 | 62.87,58.58 COL44..6 | X1.A32 8.89,9.53 15.08,15.72 v15.08,17.3 | 63.82,58.58 v61.44,56.2
  Route15 0.305: v42.39,18.26 43.34,18.26 43.5,18.1 44.13,18.1 50.16,24.13 50.16,27.46 61.59,38.89 61.59,40.32 65.72,44.45 65.72,51.91 v61.44,56.2
  Bottom 0.305: v15.08,17.3 15.72,17.94 42.07,17.94 v42.39,18.26
COL45COMMON  (via drill 0.3)
  Top 0.305: 56.52,58.58 55.24,58.58 COL45..7 | 56.52,58.58 57.78,58.58 COL45..5 | 56.52,58.58 COL45..6 | v2.38,62.87 4.13,64.61 v8.89,64.61 | v53.18,59.37 53.98,58.58 COL45..8
  Bottom 0.305: X1.C32 8.1,4.6 5.08,4.6 0.64,9.05 0.64,62.87 v2.38,62.87 | v8.89,64.61 9.68,63.82 11.11,63.82 11.43,63.5 11.43,61.12 11.27,61.12 10.79,60.64 10.79,59.05 52.86,59.05 v53.18,59.37
COLNGATE1  (via drill 0.3)
  Top 0.254: SR2.6 9.53,26.83 10.32,27.62 13.02,27.62 13.81,26.83 13.81,20.8 v14.76,19.84 | v26.67,19.21 29.05,19.21 29.84,18.41 COL1..2
  Bottom 0.254: v14.76,19.84 16.03,18.57 26.04,18.57 v26.67,19.21
COLNGATE2  (via drill 0.3)
  Top 0.254: v4.45,39.69 SR3.15 | v23.02,21.11 23.02,18.26 23.5,17.78 COL2..2
  Route15 0.254: v4.45,39.69 6.03,39.69 7.94,37.78 8.73,37.78 12.7,33.81 14.76,33.81 23.02,25.56 v23.02,21.11
COLNGATE3  (via drill 0.3)
  Top 0.254: v4.45,36.51 SR3.2 | v14.45,26.51 14.45,21.11 17.14,18.41 COL3..2
  Route15 0.254: v14.45,26.51 v4.45,36.51
COLNGATE4  (via drill 0.3)
  Top 0.254: v6.99,36.51 SR3.4 | v12.86,34.92 15.24,32.54 15.24,29.21 17.14,27.3 COL4..2
  Bottom 0.254: v6.99,36.51 8.57,34.92 v12.86,34.92
COLNGATE5  (via drill 0.3)
  Top 0.254: SR3.6 9.53,36.35 v10.79,37.62 | COL5..2 v23.5,29.05
  Route2 0.254: v17.14,37.15 17.14,35.4 v23.5,29.05
  Bottom 0.254: v10.79,37.62 11.27,37.15 v17.14,37.15
COLNGATE6  (via drill 0.3)
  Top 0.254: SR4.15 4.45,46.83 5.24,46.04 v6.19,46.04 | v26.51,24.92 28.89,24.92 29.84,25.88 COL6..2
  Route15 0.254: v6.19,46.04 9.68,46.04 14.45,41.27 14.45,37.47 22.86,29.05 22.86,28.57 v26.51,24.92
COLNGATE7  (via drill 0.3)
  Top 0.254: SR4.2 4.45,45.24 v4.6,45.4 | v34.77,33.5 35.24,33.5 35.56,33.18 35.56,30.48 36.35,29.69 36.35,28.57 36.2,28.42 COL7..2
  Route15 0.254: v4.6,45.4 14.92,35.08 15.4,35.08 v16.83,33.66
  Bottom 0.254: v16.83,33.66 17.46,33.02 34.29,33.02 v34.77,33.5
COLNGATE8  (via drill 0.3)
  Top 0.254: SR4.4 6.99,43.18 v6.35,42.55 | v42.23,29.05 43.34,29.05 44.45,27.94 44.45,25.24 44.29,25.08 43.34,25.08 42.55,25.88 COL8..2
  Bottom 0.254: v6.35,42.55 6.35,32.86 13.02,32.86 14.13,31.75 31.59,31.75 32.7,30.64 39.69,30.64 41.27,29.05 v42.23,29.05
COLNGATE9  (via drill 0.3)
  Top 0.254: SR4.6 9.53,46.04 10.48,46.99 11.59,46.99 13.81,44.77 13.81,37.15 v15.08,35.88 | v47.15,29.05 48.9,27.3 COL9..2
  Bottom 0.254: v15.08,35.88 16.19,34.77 37.15,34.77 41.12,30.8 44.93,30.8 46.67,29.05 v47.15,29.05
COLNGATE10  (via drill 0.3)
  Top 0.254: v4.45,56.83 SR5.15 | v52.39,39.05 54.61,36.83 54.61,27.3 55.24,26.67 COL10..2
  Route15 0.254: v26.04,46.67 26.04,45.09 v26.83,44.29
  Bottom 0.254: v4.45,56.83 4.45,55.09 4.29,55.09 3.81,54.61 3.81,49.21 19.53,49.21 21.11,47.62 22.7,47.62 23.18,48.1 24.61,48.1 v26.04,46.67 | v26.83,44.29 30.8,40.32 51.12,40.32 v52.39,39.05
COLNGATE11  (via drill 0.3)
  Top 0.254: v4.45,54.29 SR5.2 | v63.5,28.1 62.39,28.1 61.59,27.3 COL11..2
  Route2 0.254: v60.17,51.28 72.39,39.05 72.39,33.02 67.47,28.1 v63.5,28.1
  Bottom 0.254: v4.45,54.29 5.08,54.93 32.7,54.93 33.5,54.13 56.83,54.13 59.69,51.28 v60.17,51.28
COLNGATE12  (via drill 0.3)
  Top 0.254: v6.99,54.29 SR5.4 | v59.37,50.01 59.37,49.37 58.9,48.9 v58.9,45.72 | v68.58,28.1 68.58,27.3 67.94,26.67 COL12..2
  Route2 0.254: v58.9,45.72 63.5,41.12 63.5,29.05 62.87,28.42 62.87,27.78 63.18,27.46 67.94,27.46 v68.58,28.1
  Bottom 0.254: v6.99,54.29 8.89,52.39 53.18,52.39 55.56,50.01 v59.37,50.01
COLNGATE13  (via drill 0.3)
  Top 0.254: SR5.6 9.53,52.07 v10.16,51.44 | v34.92,42.7 35.56,42.07 35.56,34.13 36.35,33.34 39.53,33.34 v39.85,33.02 | v73.82,28.26 73.82,27.15 74.3,26.67 COL13..2
  Route2 0.254: v10.16,51.44 13.49,51.44 18.89,46.04 20.64,46.04 21.27,46.67 23.18,46.67 27.78,42.07 33.34,42.07 33.97,42.7 v34.92,42.7
  Bottom 0.254: v39.85,33.02 41.12,31.75 52.23,31.75 53.66,30.32 71.75,30.32 v73.82,28.26
COLNGATE14  (via drill 0.3)
  Top 0.254: SR6.15 17.14,59.53 16.35,60.33 15.4,60.33 v14.76,60.96 | v82.39,29.37 80.64,27.62 COL14..2
  Route2 0.254: v72.23,59.69 72.23,58.58 87,43.81 87,34.92 82.39,30.32 v82.39,29.37
  Bottom 0.254: v14.76,60.96 14.76,66.99 63.98,66.99 71.28,59.69 v72.23,59.69
COLNGATE15  (via drill 0.3)
  Top 0.254: SR6.2 17.14,52.23 18.1,51.28 v20.32,51.28 | v86.52,28.26 86.52,27.15 87,26.67 COL15..2
  Route15 0.254: v34.13,50.64 35.88,50.64 40.16,46.35 40.16,43.5 38.42,41.75 38.42,35.56 v40.48,33.5
  Bottom 0.254: v20.32,51.28 20.48,51.44 21.27,51.44 22.07,50.64 v34.13,50.64 | v40.48,33.5 41.59,32.38 82.39,32.38 v86.52,28.26
COLNGATE16  (via drill 0.3)
  Top 0.254: v19.68,56.04 SR6.4 | v86.36,33.34 86.36,34.77 87,35.4 COL16..2
  Route15 0.254: v27.94,56.2 27.94,56.52 27.78,56.67 27.78,57.31 35.08,64.61 45.56,64.61 46.83,65.88 53.66,65.88 70.64,48.9 70.64,47.47 84.77,33.34 v86.36,33.34
  Bottom 0.254: v19.68,56.04 19.84,56.2 v27.94,56.2
COLNGATE17  (via drill 0.3)
  Top 0.254: SR6.6 22.23,51.44 v22.38,51.28 | v77.95,35.88 78.74,36.67 78.74,36.83 78.9,36.99 79.85,36.99 80.64,36.2 COL17..2
  Route15 0.254: v22.38,51.28 22.38,47.31 v30.48,39.21
  Bottom 0.254: v30.48,39.21 30.48,35.24 77.31,35.24 v77.95,35.88
COLNGATE18  (via drill 0.3)
  Top 0.254: SR7.15 29.84,56.99 v29.05,56.2 | v68.42,46.04 68.42,45.88 68.58,45.72 68.58,43.02 69.37,42.23 73.5,42.23 73.66,42.07 73.66,36.2 74.3,35.56 COL18..2
  Route15 0.254: v29.05,56.2 29.05,55.4 v30.16,54.29
  Bottom 0.254: v30.16,54.29 31.59,52.86 53.5,52.86 55.72,50.64 61.44,50.64 63.18,52.39 63.82,52.39 68.42,47.78 v68.42,46.04
COLNGATE19  (via drill 0.3)
  Top 0.254: SR7.2 29.84,51.44 v29.69,51.28 | v67.31,33.97 67.31,34.77 67.94,35.4 COL19..2
  Route2 0.254: v65.88,36.51 65.88,35.4 v67.31,33.97
  Route15 0.254: v29.69,51.28 29.69,49.69 31.75,47.62 v31.75,39.21
  Bottom 0.254: v31.75,39.21 31.75,37.31 41.59,37.31 42.39,36.51 v65.88,36.51
COLNGATE20  (via drill 0.3)
  Top 0.254: SR7.4 32.38,53.5 v34.13,55.24 | v62.23,39.21 62.23,36.2 61.59,35.56 COL20..2
  Route2 0.254: v47.15,56.52 62.23,41.43 v62.23,39.21
  Bottom 0.254: v34.13,55.24 35.4,56.52 v47.15,56.52
COLNGATE21  (via drill 0.3)
  Top 0.254: v34.92,51.28 SR7.6 | v55.4,37.78 55.4,35.72 55.24,35.56 COL21..2
  Route2 0.254: v52.23,49.37 51.44,48.58 51.44,41.75 v55.4,37.78
  Bottom 0.254: v34.92,51.28 36.35,49.85 51.75,49.85 v52.23,49.37
COLNGATE22  (via drill 0.3)
  Top 0.254: SR8.15 42.55,59.69 v41.91,60.33 | v50.8,39.21 50.8,38.89 48.9,36.99 COL22..2
  Route2 0.254: v41.91,60.33 41.91,59.37 50.8,50.48 v50.8,39.21
COLNGATE23
  Top 0.254: SR8.2 42.55,51.59 41.91,50.96 41.91,39.37 44.45,36.83 44.45,34.13 44.29,33.97 43.34,33.97 42.55,34.77 COL23..2
COLNGATE24  (via drill 0.3)
  Top 0.254: SR8.4 45.09,51.59 45.72,50.96 45.72,47.62 45.09,46.99 v45.09,46.51 | v37.47,37.94 37.47,37.47 36.2,36.2 COL24..2
  Route2 0.254: v45.09,46.51 45.09,45.56 v37.47,37.94
COLNGATE25  (via drill 0.3)
  Top 0.254: SR8.6 47.62,53.5 46.83,54.29 40.8,54.29 39.53,53.02 v39.53,46.04 | v27.3,32.38 27.94,33.02 27.94,33.18 28.73,33.97 29.05,33.97 29.84,34.77 COL25..2
  Route2 0.254: v39.53,46.04 39.53,44.29 35.08,39.85 28.57,39.85 26.51,37.78 26.51,33.18 v27.3,32.38
COLNGATE26  (via drill 0.3)
  Top 0.254: SR9.15 4.45,69.06 v4.76,69.37 | v20.16,47.62 20.8,46.99 20.8,39.05 23.5,36.35 COL26..2
  Route15 0.254: v4.76,69.37 4.76,66.36 7.62,63.5 7.62,61.91 19.84,49.69 19.84,47.94 v20.16,47.62
COLNGATE27  (via drill 0.3)
  Top 0.254: v4.45,63.18 SR9.2 | v14.45,44.61 14.45,38.89 17.14,36.2 COL27..2
  Route15 0.254: v4.45,63.18 4.45,57.78 9.53,52.7 9.53,49.53 v14.45,44.61
COLNGATE28  (via drill 0.3)
  Top 0.254: v6.99,63.18 SR9.4 | v12.38,56.2 12.38,55.24 15.08,52.55 15.08,47.15 17.14,45.09 COL28..2
  Bottom 0.254: v6.99,63.18 6.99,56.2 v12.38,56.2
COLNGATE29  (via drill 0.3)
  Top 0.254: SR9.6 9.53,63.02 v9.68,63.18 | v23.34,47.31 23.34,44.61 23.5,44.45 COL29..2
  Route2 0.254: v9.68,63.18 9.68,60.96 v23.34,47.31
COLNGATE30  (via drill 0.3)
  Top 0.254: v17.14,63.34 SR10.15 | v29.21,47.94 29.21,47.62 29.84,46.99 COL30..2
  Route2 0.254: v17.14,63.34 17.14,60.01 v29.21,47.94
COLNGATE31  (via drill 0.3)
  Top 0.254: SR10.2 17.14,62.39 18.57,63.82 19.37,63.82 v20,63.18 | v35.24,46.67 35.24,46.04 36.2,45.09 COL31..2
  Route2 0.254: v20,63.18 20,61.91 v35.24,46.67
COLNGATE32  (via drill 0.3)
  Top 0.254: SR10.4 19.68,60.96 v19.05,60.33 | COL32..2 v42.55,47.31
  Route15 0.254: v19.05,60.33 19.05,59.37 v30.48,47.94
  Bottom 0.254: v30.48,47.94 31.11,47.31 v42.55,47.31
COLNGATE33  (via drill 0.3)
  Top 0.254: SR10.6 22.23,61.12 21.43,60.33 v20.32,60.33 | v46.99,42.7 47.94,42.7 48.9,43.66 COL33..2
  Route2 0.254: v20.32,60.33 20.32,58.1 29.84,48.58 31.11,48.58 v36.99,42.7
  Bottom 0.254: v46.99,42.7 v36.99,42.7
COLNGATE34  (via drill 0.3)
  Top 0.254: v29.84,65.56 SR11.15 | v54.77,46.83 54.77,44.93 55.24,44.45 COL34..2
  Route15 0.254: v46.51,63.82 54.77,55.56 v54.77,46.83
  Bottom 0.254: v29.84,65.56 29.84,63.82 31.27,63.82 31.43,63.66 41.12,63.66 41.27,63.82 v46.51,63.82
COLNGATE35  (via drill 0.3)
  Top 0.254: SR11.2 29.84,62.39 v31.75,64.29 | v60.96,48.1 60.96,45.09 61.59,44.45 COL35..2
  Route15 0.254: v48.42,63.18 56.04,55.56 56.04,52.39 60.33,48.1 v60.96,48.1
  Bottom 0.254: v31.75,64.29 31.91,64.14 40.8,64.14 41.12,64.45 46.83,64.45 48.1,63.18 v48.42,63.18
COLNGATE36  (via drill 0.3)
  Top 0.254: SR11.4 32.38,62.71 v34.92,65.25 | v52.55,62.55 52.55,57.78 51.59,56.83 51.59,54.77 51.91,54.45 53.18,54.45 53.5,54.77 54.45,54.77 54.61,54.61 54.61,48.26 57.15,45.72 57.15,43.02 57.31,42.86 67.15,42.86 67.94,43.66 COL36..2
  Bottom 0.254: v34.92,65.25 33.97,66.2 29.53,66.2 27.94,64.61 27.94,62.39 52.39,62.39 v52.55,62.55
COLNGATE37  (via drill 0.3)
  Top 0.254: SR11.6 34.92,60.96 v35.56,60.33 | v73.03,56.83 74.93,54.93 74.93,51.91 74.14,51.12 73.82,51.12 73.66,50.96 73.66,45.09 74.3,44.45 COL37..2
  Bottom 0.254: v35.56,60.33 36.67,61.44 53.34,61.44 56.83,57.94 70.64,57.94 71.75,56.83 v73.03,56.83
COLNGATE38  (via drill 0.3)
  Top 0.254: v42.55,69.37 SR12.15 | v83.98,48.1 83.66,48.1 80.64,45.09 COL38..2
  Bottom 0.254: v42.55,69.37 44.45,67.47 68.58,67.47 77.63,58.42 86.84,58.42 90.01,55.24 90.01,48.1 v83.98,48.1
COLNGATE39  (via drill 0.3)
  Top 0.254: v42.55,63.18 SR12.2 | v86.36,42.86 86.36,43.66 87,44.29 COL39..2
  Route2 0.254: v42.55,63.18 44.77,60.96 62.71,60.96 77.15,46.51 77.15,46.35 80.64,42.86 v86.36,42.86
COLNGATE40  (via drill 0.3)
  Top 0.254: SR12.4 45.09,63.34 46.35,64.61 48.58,64.61 49.05,64.14 50.32,64.14 v50.96,64.77 | v86.36,54.77 86.36,53.98 87,53.34 COL40..2
  Route2 0.254: v50.96,64.77 65.56,64.77 66.67,65.88 75.25,65.88 v86.36,54.77
COLNGATE41  (via drill 0.3)
  Top 0.254: SR12.6 47.62,63.34 v48.26,63.98 | v78.74,56.2 78.74,55.88 80.64,53.98 COL41..2
  Bottom 0.254: v48.26,63.98 48.42,64.14 54.45,64.14 54.61,64.29 65.88,64.29 72.23,57.94 80.17,57.94 80.96,57.15 80.96,56.2 v78.74,56.2
COLNGATE42
  Top 0.254: SR13.15 55.24,67.15 58.58,63.82 67.15,63.82 72.39,58.58 72.39,56.52 74.3,54.61 COL42..2
COLNGATE43  (via drill 0.3)
  Top 0.254: v55.24,63.18 SR13.2 | v63.66,61.75 66.04,59.37 66.04,55.88 67.94,53.98 COL43..2
  Bottom 0.254: v55.24,63.18 56.67,61.75 v63.66,61.75
COLNGATE44  (via drill 0.3)
  Top 0.254: SR13.4 57.78,60.48 59.05,59.21 59.05,56.04 v59.21,55.88 | v61.28,51.59 61.28,52.86 61.59,53.18 COL44..2
  Route2 0.254: v59.21,55.88 59.21,53.66 v61.28,51.59
COLNGATE45  (via drill 0.3)
  Top 0.254: v60.33,60.17 SR13.6 | v55.4,55.24 55.4,53.5 55.24,53.34 COL45..2
  Route2 0.254: v55.4,55.24 v60.33,60.17
COLPGATE1  (via drill 0.3)
  Top 0.254: SR2.7 10.79,25.4 v11.43,24.77 | v30.64,16.03 31.43,16.03 32.38,16.99 COL1..4
  Bottom 0.254: v11.43,24.77 14.13,22.07 14.13,16.67 19.05,16.67 20.48,15.24 20.48,13.49 28.73,13.49 30.64,15.4 v30.64,16.03
COLPGATE2  (via drill 0.3)
  Top 0.254: SR3.1 3.17,34.29 v2.54,33.66 | v26.83,16.67 26.04,17.46 COL2..4
  Route2 0.254: v17.46,30.16 26.04,21.59 26.04,17.46 v26.83,16.67
  Bottom 0.254: v2.54,33.66 4.29,31.91 12.38,31.91 14.13,30.16 v17.46,30.16
COLPGATE3  (via drill 0.3)
  Top 0.254: v5.71,36.51 SR3.3 | v17.78,21.43 17.78,20.48 19.68,18.57 COL3..4
  Route15 0.254: v5.71,36.51 6.03,36.51 14.29,28.26 14.76,28.26 17.78,25.24 v17.78,21.43
COLPGATE4  (via drill 0.3)
  Top 0.254: v8.26,36.51 SR3.5 | v17.3,28.89 18.73,28.89 19.68,27.94 COL4..4
  Route15 0.254: v8.26,36.51 10.79,33.97 10.79,33.34 15.24,28.89 v17.3,28.89
COLPGATE5  (via drill 0.3)
  Top 0.254: v10.79,36.67 SR3.7 | v25.72,30.16 25.72,26.99 26.04,26.67 COL5..4
  Route2 0.254: v25.72,30.16 v20.48,35.4
  Bottom 0.254: v10.79,36.67 10.95,36.51 19.37,36.51 v20.48,35.4
COLPGATE6  (via drill 0.3)
  Top 0.254: SR4.1 3.17,43.02 v2.38,42.23 | v31.27,29.21 31.91,28.57 31.91,27.15 32.38,26.67 COL6..4
  Bottom 0.254: v2.38,42.23 2.38,34.29 2.22,34.29 1.91,33.97 1.91,31.43 11.75,31.43 13.65,29.53 23.02,29.53 23.18,29.69 25.24,29.69 25.72,29.21 v31.27,29.21
COLPGATE7  (via drill 0.3)
  Top 0.254: SR4.3 5.71,43.18 v5.08,42.55 | v39.53,27.46 38.73,26.67 COL7..4
  Bottom 0.254: v5.08,42.55 5.08,32.38 12.7,32.38 13.81,31.27 31.27,31.27 32.54,30 36.99,30 v39.53,27.46
COLPGATE8  (via drill 0.3)
  Top 0.254: SR4.5 8.26,43.18 v8.89,42.55 | v12.86,41.91 12.86,36.67 v15.08,34.45 | v42.86,29.69 43.5,29.69 45.09,28.1 COL8..4
  Bottom 0.254: v8.89,42.55 9.53,41.91 v12.86,41.91 | v15.08,34.45 15.24,34.29 36.83,34.29 41.43,29.69 v42.86,29.69
COLPGATE9  (via drill 0.3)
  Top 0.254: v10.79,46.35 SR4.7 | v52.55,27.78 51.44,26.67 COL9..4
  Route2 0.254: v47.94,46.51 49.53,44.93 49.53,33.97 54.61,28.89 54.61,28.1 54.29,27.78 v52.55,27.78
  Bottom 0.254: v10.79,46.35 10.95,46.2 18.73,46.2 19.53,45.4 46.83,45.4 v47.94,46.51
COLPGATE10  (via drill 0.3)
  Top 0.254: SR5.1 3.17,51.91 2.38,51.12 v2.38,50.8 | v55.4,29.69 57.78,27.3 COL10..4
  Route2 0.254: v51.59,37.78 51.59,33.5 v55.4,29.69
  Bottom 0.254: v2.38,50.8 2.38,47.31 5.87,47.31 6.83,46.35 6.83,44.45 13.65,44.45 14.29,43.81 26.35,43.81 30.32,39.85 49.21,39.85 50.64,38.42 50.96,38.42 v51.59,37.78
COLPGATE11  (via drill 0.3)
  Top 0.254: v5.71,55.56 SR5.3 | v64.93,28.73 64.93,27.46 64.14,26.67 COL11..4
  Route2 0.254: v53.82,55.4 53.82,54.45 60.33,47.94 60.33,47.78 70.96,37.15 71.6,37.15 71.91,36.83 71.91,35.72 v64.93,28.73
  Bottom 0.254: v5.71,55.56 5.87,55.4 33.02,55.4 33.81,54.61 50.8,54.61 51.91,55.72 53.5,55.72 v53.82,55.4
COLPGATE12  (via drill 0.3)
  Top 0.254: SR5.5 8.26,52.07 v8.89,51.44 | v71.28,27.46 70.48,26.67 COL12..4
  Route2 0.254: v46.99,51.12 46.99,46.51 49.05,44.45 49.05,33.66 53.98,28.73 v53.98,28.42
  Bottom 0.254: v8.89,51.44 9.53,50.8 18.89,50.8 20,51.91 46.2,51.91 v46.99,51.12 | v53.98,28.42 54.93,27.46 v71.28,27.46
COLPGATE13  (via drill 0.3)
  Top 0.254: SR5.7 10.79,52.23 11.59,51.44 12.54,51.44 v13.81,50.16 | v77.63,26.35 76.99,26.35 76.83,26.51 COL13..4
  Route2 0.254: v43.81,47.62 44.29,47.15 45.56,47.15 48.1,44.61 48.1,27.78 v50.8,25.08
  Bottom 0.254: v13.81,50.16 14.29,49.69 35.72,49.69 36.67,48.74 42.7,48.74 v43.81,47.62 | v50.8,25.08 52.07,26.35 v77.63,26.35
COLPGATE14  (via drill 0.3)
  Top 0.254: SR6.1 15.88,51.59 16.51,50.96 v16.51,47.15 | v83.98,26.51 83.19,26.51 COL14..4
  Route2 0.254: v16.51,47.15 16.51,44.29 14.45,42.23 14.45,28.57 19.68,23.34 19.68,9.84 20.48,9.05 20.48,6.51 23.02,3.97 23.02,3.33 24.29,2.06 64.61,2.06 66.2,3.65 66.2,6.19 68.74,8.73 68.74,11.27 v83.98,26.51
COLPGATE15  (via drill 0.3)
  Top 0.254: SR6.3 18.41,55.72 v18.73,56.04 | v90.96,35.4 90.96,28.89 89.53,27.46 COL15..4
  Route2 0.254: v18.73,56.04 20.32,54.45 20.32,54.29 31.11,43.5 v31.11,42.7
  Bottom 0.254: v31.11,42.7 31.75,43.34 50.64,43.34 52.23,41.75 84.61,41.75 v90.96,35.4
COLPGATE16  (via drill 0.3)
  Top 0.254: v20.95,50.8 SR6.5 | v88.27,39.05 88.27,38.1 89.53,36.83 COL16..4
  Route15 0.254: v20.95,50.8 22.07,51.91 22.7,51.91 27.78,46.83 v27.78,44.29
  Bottom 0.254: v27.78,44.29 28.26,43.81 50.96,43.81 52.55,42.23 85.09,42.23 v88.27,39.05
COLPGATE17  (via drill 0.3)
  Top 0.254: SR6.7 23.5,53.5 22.7,54.29 v21.91,54.29 | v81.76,38.26 83.19,36.83 COL17..4
  Route15 0.254: v21.91,54.29 21.91,55.72 18.41,59.21 18.41,63.5 22.86,67.94 55.72,67.94 81.76,41.91 v81.76,38.26
COLPGATE18  (via drill 0.3)
  Top 0.254: SR7.1 28.57,51.59 27.94,50.96 27.94,48.1 29.21,46.83 v29.21,42.86 | v77.31,37.15 77.31,36.04 76.83,35.56 COL18..4
  Bottom 0.254: v29.21,42.86 30.8,41.27 73.34,41.27 77.31,37.31 v77.31,37.15
COLPGATE19  (via drill 0.3)
  Top 0.254: v31.11,54.29 SR7.3 | v71.28,36.51 70.48,35.72 COL19..4
  Route2 0.254: v56.04,51.28 70.8,36.51 v71.28,36.51
  Bottom 0.254: v31.11,54.29 31.75,53.66 53.66,53.66 v56.04,51.28
COLPGATE20  (via drill 0.3)
  Top 0.254: SR7.5 33.66,53.5 v35.4,55.24 | v64.93,40.48 64.93,36.35 64.14,35.56 COL20..4
  Route2 0.254: v49.53,56.2 59.69,46.04 59.69,45.72 v64.93,40.48
  Bottom 0.254: v35.4,55.24 48.58,55.24 v49.53,56.2
COLPGATE21  (via drill 0.3)
  Top 0.254: v36.2,51.28 SR7.7 | v57.15,39.21 57.15,36.2 57.78,35.56 COL21..4
  Route2 0.254: v53.18,49.53 57.15,45.56 v57.15,39.21
  Bottom 0.254: v36.2,51.28 36.99,50.48 52.55,50.48 53.18,49.85 v53.18,49.53
COLPGATE22  (via drill 0.3)
  Top 0.254: v41.27,51.28 SR8.1 | v50.64,37.78 51.44,36.99 COL22..4
  Route15 0.254: v41.27,39.05 v41.27,51.28
  Bottom 0.254: v41.27,39.05 42.55,37.78 v50.64,37.78
COLPGATE23  (via drill 0.3)
  Top 0.254: SR8.3 43.81,51.75 v43.18,51.12 | v42.07,33.5 44.61,33.5 45.09,33.97 COL23..4
  Route15 0.254: v43.18,51.12 43.18,38.58 42.07,37.47 v42.07,33.5
COLPGATE24  (via drill 0.3)
  Top 0.254: SR8.5 46.35,47.47 45.72,46.83 v45.72,46.04 | v39.85,35.88 39.05,35.88 38.73,35.56 COL24..4
  Route2 0.254: v45.72,46.04 45.72,41.75 v39.85,35.88
COLPGATE25  (via drill 0.3)
  Top 0.254: SR8.7 48.9,51.44 v48.74,51.28 | v33.18,36.67 33.18,36.35 32.38,35.56 COL25..4
  Route2 0.254: v48.74,51.28 48.1,51.91 46.2,51.91 40.16,45.88 40.16,43.66 v33.18,36.67
COLPGATE26  (via drill 0.3)
  Top 0.254: SR9.1 3.17,62.87 4.29,63.98 v5.87,63.98 | v23.18,39.05 26.04,36.2 COL26..4
  Route15 0.254: v5.87,63.98 6.35,63.5 6.35,57.47 13.18,50.64 13.18,49.53 23.18,39.53 v23.18,39.05
COLPGATE27  (via drill 0.3)
  Top 0.254: v5.71,63.18 SR9.3 | v19.21,37.31 19.21,36.04 19.68,35.56 COL27..4
  Route15 0.254: v5.71,63.18 5.71,57.31 11.27,51.75 11.27,48.74 19.21,40.8 v19.21,37.31
COLPGATE28  (via drill 0.3)
  Top 0.254: v8.26,63.18 SR9.5 | v19.37,47.47 19.84,46.99 19.84,44.61 19.68,44.45 COL28..4
  Route2 0.254: v8.26,63.18 8.26,61.28 19.37,50.16 v19.37,47.47
COLPGATE29  (via drill 0.3)
  Top 0.254: v10.79,63.18 SR9.7 | v24.29,47.47 26.04,45.72 COL29..4
  Route2 0.254: v10.79,63.18 10.79,61.91 24.29,48.42 v24.29,47.47
COLPGATE30  (via drill 0.3)
  Top 0.254: v15.88,63.18 SR10.1 | v30.48,46.99 32.38,45.09 COL30..4
  Route15 0.254: v15.88,63.18 15.88,57.94 21.43,52.39 23.81,52.39 29.21,46.99 v30.48,46.99
COLPGATE31  (via drill 0.3)
  Top 0.254: SR10.3 18.41,62.55 v19.05,63.18 | v38.42,46.04 38.42,44.77 38.73,44.45 COL31..4
  Route2 0.254: v19.05,63.18 19.68,63.82 20.32,63.82 20.48,63.66 20.64,63.82 21.27,63.82 21.59,63.5 21.59,62.55 27.3,56.83 27.3,55.88 35.88,47.31 37.15,47.31 v38.42,46.04
COLPGATE32  (via drill 0.3)
  Top 0.254: v20.95,63.18 SR10.5 | v44.45,48.1 44.45,45.09 45.09,44.45 COL32..4
  Route15 0.254: v20.95,63.18 27.3,56.83 27.3,55.88 31.27,51.91 43.34,51.91 44.45,50.8 v44.45,48.1
COLPGATE33  (via drill 0.3)
  Top 0.254: SR10.7 23.5,63.02 v23.65,63.18 | v53.82,47.94 53.82,46.99 52.7,45.88 52.7,45.72 51.44,44.45 COL33..4
  Route2 0.254: v23.65,63.18 30.96,55.88 v44.45,55.88
  Route15 0.254: v44.45,55.88 48.74,55.88 49.05,55.56 51.75,55.56 51.91,55.72 52.55,55.72 53.82,54.45 v53.82,47.94
COLPGATE34  (via drill 0.3)
  Top 0.254: SR11.1 28.57,62.39 29.37,63.18 v29.69,63.18 | v58.26,46.51 58.26,44.93 57.78,44.45 COL34..4
  Route2 0.254: v29.69,63.18 30.48,63.18 34.61,59.05 39.69,59.05 41.59,60.96 43.66,60.96 53.66,50.96 53.82,50.96 v58.26,46.51
COLPGATE35  (via drill 0.3)
  Top 0.254: SR11.3 31.11,62.39 v33.5,64.77 | v64.93,45.56 64.14,44.77 COL35..4
  Route15 0.254: v49.37,64.77 64.93,49.21 v64.93,45.56
  Bottom 0.254: v33.5,64.77 33.66,64.61 40.16,64.61 40.48,64.93 49.21,64.93 v49.37,64.77
COLPGATE36  (via drill 0.3)
  Top 0.254: SR11.5 33.66,61.12 32.86,60.33 28.1,60.33 v27.62,60.8 | v70.96,46.04 70.96,44.93 70.48,44.45 COL36..4
  Route2 0.254: v62.55,60.17 62.55,54.45 v70.96,46.04
  Bottom 0.254: v27.62,60.8 28.73,61.91 53.66,61.91 56.04,59.53 61.91,59.53 v62.55,60.17
COLPGATE37  (via drill 0.3)
  Top 0.254: SR11.7 36.2,63.34 v38.1,65.25 | v76.2,46.04 76.2,45.09 76.83,44.45 COL37..4
  Route15 0.254: v38.1,65.25 43.5,65.25 45.72,67.47 54.13,67.47 60.96,60.64 60.96,59.85 63.34,57.47 64.77,57.47 v76.2,46.04
COLPGATE38  (via drill 0.3)
  Top 0.254: SR12.1 41.27,62.87 v41.59,63.18 | v83.98,45.4 83.19,44.61 COL38..4
  Route15 0.254: v41.59,63.18 42.55,64.14 45.88,64.14 47.15,65.41 52.07,65.41 60.64,56.83 61.75,56.83 v64.93,53.66
  Bottom 0.254: v64.93,53.66 66.36,52.23 80.49,52.23 83.34,49.37 83.34,45.4 v83.98,45.4
COLPGATE39  (via drill 0.3)
  Top 0.254: SR12.3 43.81,62.71 v44.29,63.18 | v87.47,47.15 89.53,45.09 COL39..4
  Route2 0.254: v44.29,63.18 44.29,65.25 46.04,66.99 75.09,66.99 87.47,54.61 v87.47,47.15
COLPGATE40  (via drill 0.3)
  Top 0.254: SR12.5 46.35,62.87 v46.04,63.18 | v89.38,54.93 89.38,53.5 89.53,53.34 COL40..4
  Route15 0.254: v46.04,63.18 46.04,61.59 v50.16,57.47
  Bottom 0.254: v50.16,57.47 70.33,57.47 72.23,55.56 88.74,55.56 v89.38,54.93
COLPGATE41  (via drill 0.3)
  Top 0.254: SR12.7 48.9,62.39 v49.69,63.18 | v80.33,56.83 83.19,53.98 COL41..4
  Bottom 0.254: v49.69,63.18 50.16,63.66 54.77,63.66 54.93,63.82 65.56,63.82 71.91,57.47 79.69,57.47 v80.33,56.83
COLPGATE42  (via drill 0.3)
  Top 0.254: SR13.1 53.98,60.48 54.61,59.85 54.61,57.15 v56.67,55.09 | v77.63,54.29 76.83,53.5 COL42..4
  Bottom 0.254: v56.67,55.09 57.47,54.29 v77.63,54.29
COLPGATE43  (via drill 0.3)
  Top 0.254: SR13.3 56.52,60.33 v56.36,60.17 | v66.36,60.8 67.31,59.85 67.31,57.15 70.48,53.98 COL43..4
  Bottom 0.254: v56.36,60.17 56.99,60.8 v66.36,60.8
COLPGATE44  (via drill 0.3)
  Top 0.254: SR13.5 59.05,60.01 59.69,59.37 v59.69,56.83 | v63.66,56.83 63.66,53.82 64.14,53.34 COL44..4
  Bottom 0.254: v63.66,56.83 v59.69,56.83
COLPGATE45  (via drill 0.3)
  Top 0.254: v61.59,60.17 SR13.7 | v58.58,53.66 58.1,53.66 57.78,53.34 COL45..4
  Route2 0.254: v61.59,60.17 61.59,59.69 58.58,56.67 v58.58,53.66
FLIPVOLTPOSITIVE  (via drill 0.3)
  Top 0.305: COL35..3 62.87,45.56 62.71,45.72 62.71,46.35 62.79,46.43 | 62.79,46.43 64.45,48.1 64.61,48.1 64.93,48.42 64.93,50.8 64.69,51.04 | 64.69,51.04 63.98,51.75 63.66,51.75 62.87,52.55 COL44..3 62.87,53.98 61.28,55.56 60.01,55.56 59.69,55.24 57.78,55.24 56.52,53.98 COL45..3 | COL43..3 69.22,52.55 67.79,51.12 64.77,51.12 64.69,51.04 | v18.41,37.15 COL27..3 | v18.57,42.39 18.57,44.13 18.41,44.29 COL28..3 | COL26..3 24.77,36.2 21.43,39.53 v21.43,39.85 21.43,41.91 21.75,42.23 29.69,42.23 31.11,43.66 COL30..3 31.11,45.09 30.48,45.72 v30.48,46.04 | v24.77,46.04 COL29..3 | v37.47,46.04 COL31..3 | v43.81,46.04 COL32..3 | v62.55,46.67 62.79,46.43 | R10.2 60.33,15.24 v60.64,15.56 | R8.2 68.1,15.24 68.1,14.92 67.31,14.13 65.56,14.13 64.93,14.76 v64.93,16.03 64.93,17.14 65.41,17.62 ROW4..3 65.41,18.41 62.07,21.75 62.07,24.29 63.26,25.48 | COL38..3 81.92,45.09 82.87,46.04 87.31,46.04 88.27,45.09 COL39..3 88.27,43.66 89.69,42.23 90.01,42.23 90.33,41.91 90.33,33.18 90.25,33.1 | R6.2 76.99,15.24 76.99,14.92 76.2,14.13 74.45,14.13 74.3,14.29 ROW3..3 74.3,18.41 67.63,25.08 | 93.9,19.13 93.82,19.21 92.87,19.21 92.08,18.41 ROW1..3 | 93.9,19.13 94.77,18.26 94.77,15.24 R2.2 | R4.2 85.88,15.24 85.88,18.26 84.93,19.21 83.98,19.21 83.19,18.41 ROW2..3 83.19,18.57 82.07,19.68 80.33,19.68 79.85,20.16 79.85,24.77 | COL11..3 62.87,25.88 63.26,25.48 | 63.26,25.48 63.66,25.08 67.63,25.08 | 67.63,25.08 68.42,25.08 68.5,25.16 | 68.5,25.16 69.22,25.88 COL12..3 | 68.5,25.16 68.58,25.08 74.77,25.08 75.56,25.88 COL13..3 75.56,25.72 76.52,24.77 79.85,24.77 | COL14..3 81.92,25.88 81.2,25.16
  Top 0.305: 81.2,25.16 80.8,24.77 79.85,24.77 | 87.55,25.16 87.47,25.08 81.28,25.08 81.2,25.16 | 87.55,25.16 88.27,25.88 COL15..3 88.27,27.3 90.33,29.37 90.33,33.02 90.25,33.1 | 90.25,33.1 90.01,33.34 89.69,33.34 88.27,34.77 COL16..3 v88.27,37.15 | 93.9,19.13 93.98,19.21 93.98,21.59 94.14,21.75 94.14,24.13 93.19,25.08 87.63,25.08 87.55,25.16 | v47.31,14.45 47.31,17.3 47.62,17.62 ROW6..3 47.62,18.41 48.42,19.21 49.37,19.21 49.69,18.89 49.69,16.19 50.32,15.56 | R14.2 41.43,15.24 v41.43,13.97 v39.37,13.97 | 50.32,15.56 50.32,15.24 R12.2 50.32,15.56 | ROW7..3 38.73,16.19 v38.58,16.03 | 50.32,15.56 50.96,16.19 v50.96,17.14 50.96,19.21 50.16,20 COL9..3 50.16,27.3 51.91,29.05 v52.7,29.05 | ROW5..3 56.52,15.72 v56.04,15.24 | COL10..3 56.52,27.62 v55.24,28.89 | COL3..3 18.41,18.89 v17.94,19.37 | COL2..3 24.77,18.57 v24.13,19.21 24.29,19.21 24.92,19.84 29.69,19.84 31.11,18.41 COL1..3 | 42.86,28.1 43.02,28.1 43.81,27.3 COL8..3 | 42.86,28.1 38.26,28.1 37.47,27.3 COL7..3 37.47,27.46 v36.83,28.1 | v18.41,28.26 COL4..3 | v24.13,28.26 24.13,27.94 24.77,27.3 COL5..3 | COL6..3 31.11,28.1 v31.27,28.26 | COL25..3 31.11,34.45 v31.91,33.66 | 42.86,28.1 v42.86,28.42 | COL19..3 69.22,34.77 70.01,33.97 74.77,33.97 75.56,34.77 COL18..3 v75.56,37.15 75.56,37.47 77.63,39.53 77.63,41.91 76.68,42.86 74.93,42.86 74.85,42.94 | COL36..3 69.22,43.66 70.01,42.86 74.77,42.86 74.85,42.94 | 74.85,42.94 75.56,43.66 COL37..3 75.56,46.35 77.63,48.42 77.63,50.8 76.68,51.75 76.36,51.75 75.56,52.55 COL42..3 75.56,55.24 77.63,57.31 77.63,58.26 | 77.63,60.96 77.63,58.26 | COL41..3 81.92,53.98 77.63,58.26 | COL40..3 88.27,54.77 90.49,56.99 90.81,56.99
  Top 0.305: COL21..3 v56.52,37.62 54.93,39.21 53.5,39.21 52.23,40.48 52.23,41.91 51.99,42.15 | 51.99,42.15 51.28,42.86 50.96,42.86 50.16,43.66 COL33..3 v50.16,47.15 | COL34..3 56.52,43.66 55.09,42.23 52.07,42.23 51.99,42.15 | COL24..3 37.47,36.2 38.26,36.99 43.02,36.99 43.1,36.91 | 43.1,36.91 43.81,36.2 COL23..3 | v50.16,37.15 COL22..3 | v43.18,37.15 43.18,36.99 43.1,36.91 | v62.87,37.15 COL20..3 | v81.92,37.15 COL17..3
  Top 0.813: FLIPCAP.+ 72.39,60.96 77.63,60.96 90.81,60.96 90.81,56.99 90.81,55.88 JP1.3
  Route2 0.305: v55.24,28.89 55.56,28.89 56.52,29.84 v56.52,37.62
  Route15 0.305: v31.91,33.66 31.91,28.89 v31.27,28.26 | v17.94,19.37 17.94,20.64 18.41,21.11 v18.41,28.26
  Bottom 0.305: 18.41,39.85 18.41,42.39 v18.57,42.39 | 18.41,39.85 v18.41,37.15 | v24.77,46.04 v30.48,46.04 v37.47,46.04 38.1,46.67 43.18,46.67 v43.81,46.04 43.81,46.2 44.77,47.15 v50.16,47.15 53.98,47.15 54.29,47.47 61.75,47.47 v62.55,46.67 | v21.43,39.85 18.41,39.85 | v60.64,15.56 61.12,16.03 v64.93,16.03 | v41.43,13.97 41.91,14.45 v47.31,14.45 | v38.58,16.03 38.58,13.97 v39.37,13.97 | v56.04,15.24 54.13,17.14 v50.96,17.14 | v55.24,28.89 55.09,29.05 v52.7,29.05 52.07,28.42 v42.86,28.42 | v17.94,19.37 18.1,19.21 v24.13,19.21 | v18.41,28.26 v24.13,28.26 24.29,28.42 27.78,28.42 28.57,27.62 30.64,27.62 30.72,27.7 | 30.72,27.7 v31.27,28.26 | v36.83,28.1 36.35,27.62 30.8,27.62 30.72,27.7 | v43.18,37.15 v50.16,37.15 56.52,37.15 | 56.52,37.15 v62.87,37.15 71.6,37.15 72.23,36.51 75.56,36.51 | 75.56,36.51 81.28,36.51 v81.92,37.15 v88.27,37.15 | 56.52,37.15 v56.52,37.62 | 75.56,36.51 v75.56,37.15
GND  (via drill 0.3)
  Top 0.406: R13.1 35.4,15.24 35.4,16.83 36.2,17.62 ROW7..1 36.04,17.78 34.92,18.89 COL7..1 35.08,26.67 35.08,29.21 v35.24,29.37 | v41.27,33.81 COL23..1 | COL22..1 47.62,35.4 47.15,34.92 v47.15,33.81 47.31,33.97 51.91,33.97 53.34,35.4 53.98,35.4 COL21..1 | 65.25,33.97 61.12,33.97 60.33,34.77 COL20..1 60.48,34.45 v59.85,33.81 | 65.25,33.97 66.67,35.4 COL19..1 66.83,35.56 66.83,36.51 67.63,37.31 71.44,37.31 72.07,36.67 72.07,36.51 73.03,35.56 COL18..1 | COL12..1 66.67,28.89 65.25,30.32 | 65.25,33.97 65.25,30.32 | R11.1 44.29,15.24 44.29,16.83 45.09,17.62 ROW6..1 44.93,17.78 44.93,20.95 | COL8..1 41.27,25.88 42.7,24.45 44.29,24.45 | 44.29,24.45 45.56,24.45 47.62,26.51 COL9..1 | 44.93,20.95 44.29,21.59 44.29,24.45 | R7.1 62.07,15.24 62.07,16.83 62.87,17.62 ROW4..1 62.71,17.78 62.71,20.32 58.42,24.61 58.42,24.77 | R9.1 53.18,15.24 53.18,16.83 53.98,17.62 ROW5..1 53.82,17.78 53.82,20.95 53.18,21.59 53.18,22.07 | COL10..1 53.98,25.88 54.37,25.48 | 54.37,25.48 55.09,24.77 58.42,24.77 | 58.42,24.77 59.37,24.77 60.33,25.72 COL11..1 60.48,26.67 60.48,27.62 61.59,28.73 63.18,28.73 64.77,30.32 65.25,30.32 | 53.18,22.07 53.18,24.29 54.37,25.48 | v45.09,20.95 44.93,20.95 | v53.02,22.07 53.18,22.07 | 83.98,42.86 84.3,42.86 85.33,43.89 | 83.98,42.86 80.17,42.86 79.38,43.66 COL38..1 79.22,44.45 78.26,45.4 78.26,50.48 79.38,51.59 COL41..1 79.22,53.34 79.22,53.66 77.79,55.09 77.31,55.09 v77.15,54.93 | 85.33,43.89 85.72,44.29 COL39..1 | COL13..1 73.03,28.42 73.66,29.05 76.99,29.05 78.98,27.07 | 78.98,27.07 79.38,26.67 COL14..1 | COL17..1 79.38,34.77 80.17,33.97 83.98,33.97 | 84.3,33.97 83.98,33.97